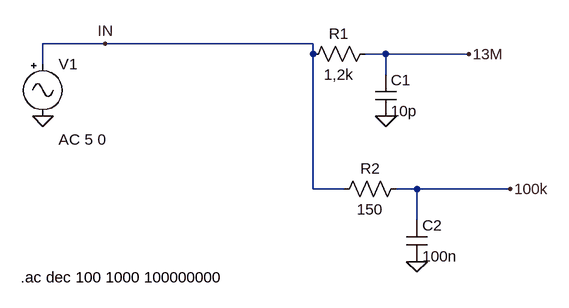
[diagram p0: schematic Draft2.asc]
Draft2.asc, the LTspice schematic file:
Version 4
SHEET 1 880 680
WIRE -256 48 -352 48
WIRE 64 48 -256 48
WIRE 64 64 64 48
WIRE 176 64 144 64
WIRE 304 64 176 64
WIRE -352 80 -352 48
WIRE 176 96 176 64
WIRE 64 272 64 64
WIRE 112 272 64 272
WIRE 224 272 192 272
WIRE 368 272 224 272
WIRE 224 320 224 272
FLAG 176 160 0
FLAG 224 384 0
FLAG -352 160 0
FLAG 304 64 13M
FLAG 368 272 100k
FLAG -256 48 IN
SYMBOL res 160 48 R90
WINDOW 0 0 56 VBottom 2
WINDOW 3 32 56 VTop 2
SYMATTR InstName R1
SYMATTR Value 1,2k
SYMBOL res 208 256 R90
WINDOW 0 0 56 VBottom 2
WINDOW 3 32 56 VTop 2
SYMATTR InstName R2
SYMATTR Value 150
SYMBOL cap 160 96 R0
SYMATTR InstName C1
SYMATTR Value 10p
SYMBOL cap 208 320 R0
SYMATTR InstName C2
SYMATTR Value 100n
SYMBOL Misc\\signal -352 64 R0
WINDOW 123 24 132 Left 2
WINDOW 39 0 0 Left 0
SYMATTR InstName V1
SYMATTR Value ""
SYMATTR Value2 AC 5 0
TEXT -386 408 Left 2 !.ac dec 100 1000 100000000

The netlist it stands for:
* Draft2.asc
R1 13M IN 1,2k
R2 100k IN 150
C1 13M 0 10p
C2 100k 0 100n
V1 IN 0 AC 5 0
.ac dec 100 1000 100000000
.backanno
.end

* Results of the author's LTspice run, read from the files saved beside the schematic
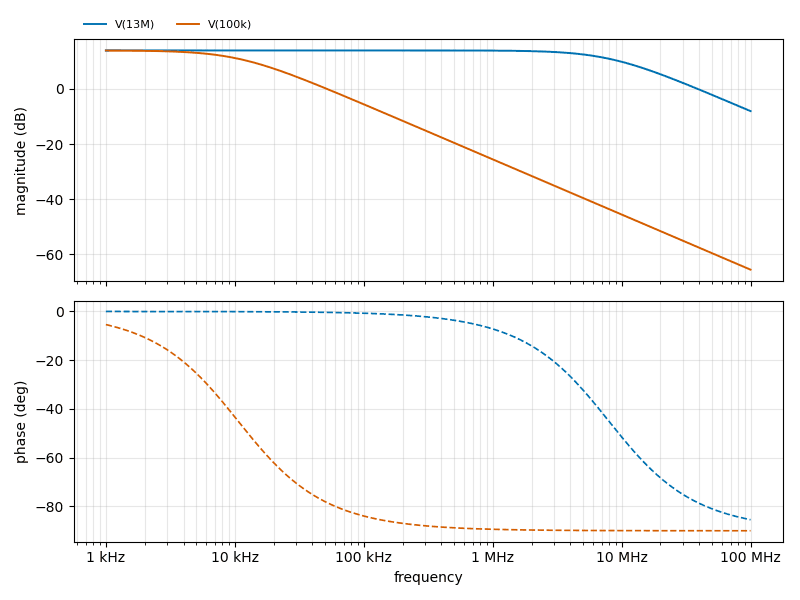
[diagram p1: AC Analysis of Draft2.asc, plotted from the saved traces]
* AC Analysis, 1 run:
*   V(13M): 13.98 dB at 1 kHz, -8.03 dB at 100 MHz, peak 13.98 dB at 1 kHz, 3 dB below the peak at 7.958 MHz
*   V(100k): 13.94 dB at 1 kHz, -65.51 dB at 100 MHz, peak 13.94 dB at 1 kHz, 3 dB below the peak at 10.7 kHz